# Altium schematic sheet TEST_USB.SchDoc
size A4
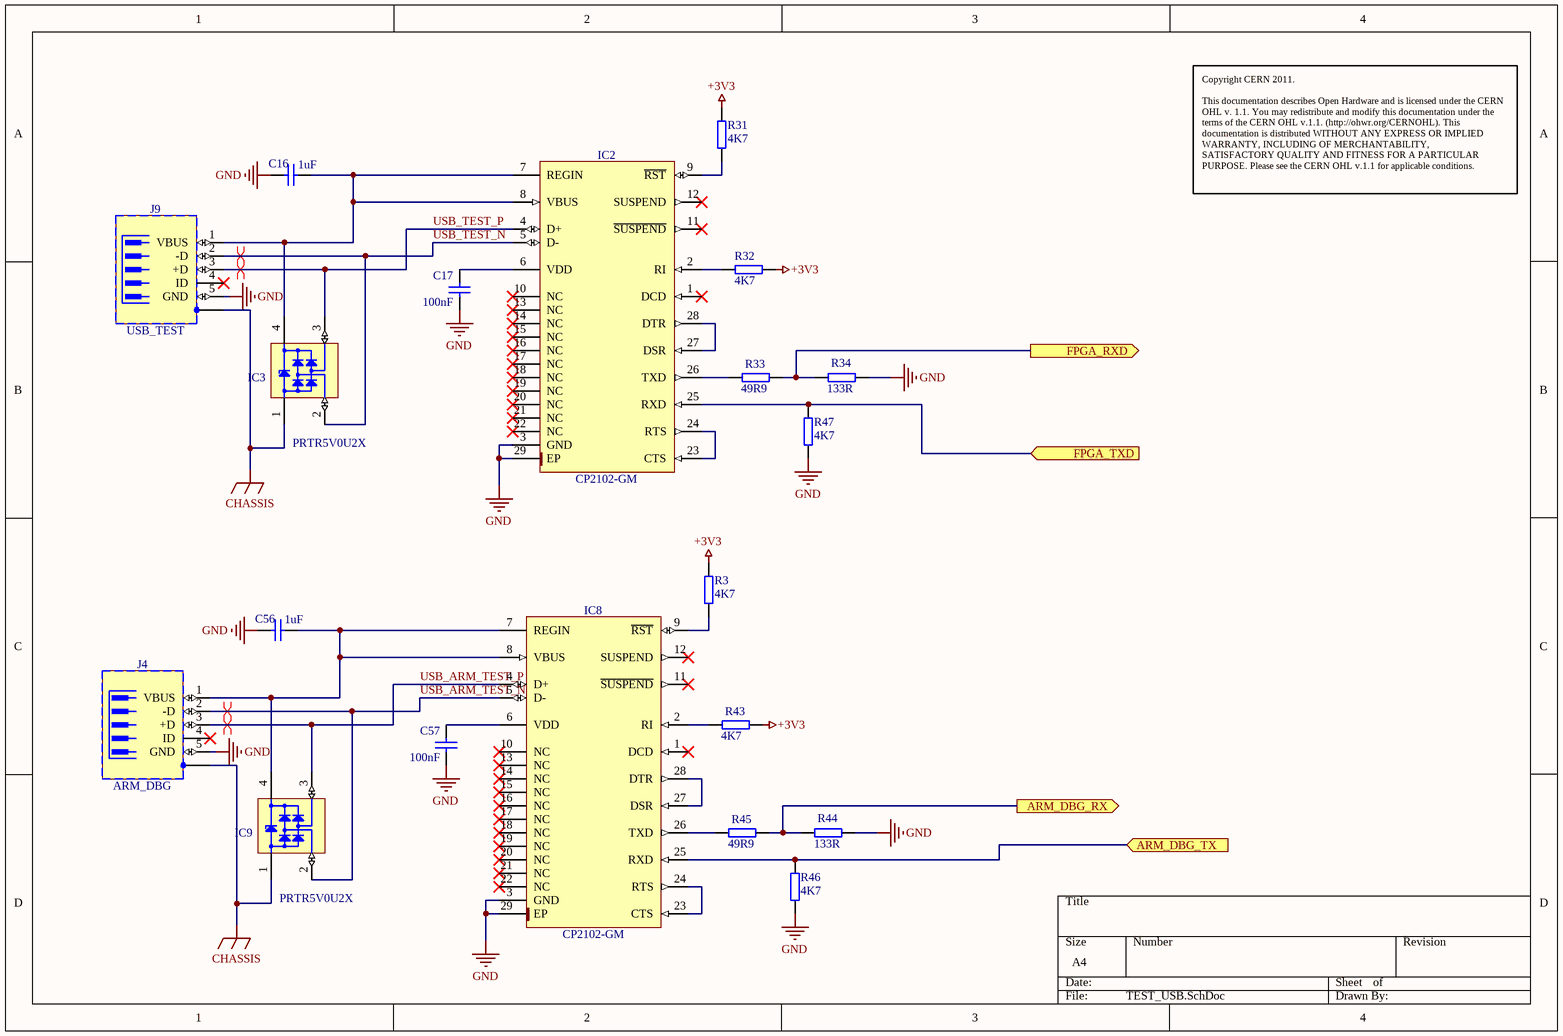
[diagram p0: TEST_USB.SchDoc]

## Parts
C16  1uF  [CC1608-0603]
C17  100nF  [CC1608-0603]
C56  1uF  [CC1608-0603]
C57  100nF  [CC1608-0603]
IC2  CP2102-GM  [QFN50P500X500X100-29N-S335]
IC3  PRTR5V0U2X  [SOT190P230X110-4N]
IC8  CP2102-GM  [QFN50P500X500X100-29N-S335]
IC9  PRTR5V0U2X  [SOT190P230X110-4N]
J4  ARM_DBG  [TYCO_1734035-1]
J9  USB_TEST  [TYCO_1734035-1]
R3  4K7  [0603]
R31  4K7  [0603]
R32  4K7  [0603]
R33  49R9  [0603]
R34  133R  [0603]
R43  4K7  [0603]
R44  133R  [0603]
R45  49R9  [0603]
R46  4K7  [0603]
R47  4K7  [0603]

## Ports
ARM_DBG_RX (out), ARM_DBG_TX (in), FPGA_RXD (out), FPGA_TXD (in)

## Nets
+3V3: R3.1 R31.1 R32.2 R43.2
CHASSIS: IC3.1(GND) IC9.1(GND) J4.6(SH) J9.6(SH)
GND: C16.1 C17.2 C56.1 C57.2 IC2.3(GND) IC2.29(EP) IC8.3(GND) IC8.29(EP) J4.5(GND) J9.5(GND) R34.2 R44.2 R46.2 R47.2
ARM_DBG_RX: R44.1 R45.2 ; port ARM_DBG_RX
ARM_DBG_TX: IC8.25(RXD) R46.1 ; port ARM_DBG_TX
FPGA_RXD: R33.2 R34.1 ; port FPGA_RXD
FPGA_TXD: IC2.25(RXD) R47.1 ; port FPGA_TXD
USB_ARM_TEST_N: IC8.5(D-) IC9.2(I/O1) J4.2(-D)
USB_ARM_TEST_P: IC8.4(D+) IC9.3(I/O2) J4.3(+D)
USB_TEST_N: IC2.5(D-) IC3.2(I/O1) J9.2(-D)
USB_TEST_P: IC2.4(D+) IC3.3(I/O2) J9.3(+D)
NetC16_2: C16.2 IC2.7(REGIN) IC2.8(VBUS) IC3.4(VCC) J9.1(VBUS)
NetC17_1: C17.1 IC2.6(VDD)
NetC56_2: C56.2 IC8.7(REGIN) IC8.8(VBUS) IC9.4(VCC) J4.1(VBUS)
NetC57_1: C57.1 IC8.6(VDD)
NetIC2_2: IC2.2(RI) R32.1
NetIC2_9: IC2.9(~{RST}) R31.2
NetIC2_23: IC2.23(CTS) IC2.24(RTS)
NetIC2_26: IC2.26(TXD) R33.1
NetIC2_27: IC2.27(DSR) IC2.28(DTR)
NetIC8_2: IC8.2(RI) R43.1
NetIC8_9: IC8.9(~{RST}) R3.2
NetIC8_23: IC8.23(CTS) IC8.24(RTS)
NetIC8_26: IC8.26(TXD) R45.1
NetIC8_27: IC8.27(DSR) IC8.28(DTR)

Not connected (* = marked no-connect by the designer): IC2 1(DCD)* 10(NC)* 11(~{SUSPEND})* 12(SUSPEND)* 13(NC)* 14(NC)* 15(NC)* 16(NC)* 17(NC)* 18(NC)* 19(NC)* 20(NC)* 21(NC)* 22(NC)*; IC8 1(DCD)* 10(NC)* 11(~{SUSPEND})* 12(SUSPEND)* 13(NC)* 14(NC)* 15(NC)* 16(NC)* 17(NC)* 18(NC)* 19(NC)* 20(NC)* 21(NC)* 22(NC)*; J4 4(ID)*; J9 4(ID)*

## Layout directives
differential pair: USB_ARM_TEST_N, USB_ARM_TEST_P, USB_TEST_N, USB_TEST_P

## Notes on the sheet
- Copyright CERN 2011.
  This documentation describes Open Hardware and is licensed under the CERN OHL v. 1.1. You may redistribute and modify this documentation under the terms of the CERN OHL v.1.1. (http://ohwr.org/CERNOHL). This documentation is distributed WITHOUT ANY EXPRESS OR IMPLIED WARRANTY, INCLUDING OF MERCHANTABILITY, SATISFACTORY QUALITY AND FITNESS FOR A PARTICULAR PURPOSE. Please see the CERN OHL v.1.1 for applicable conditions.

## Library data of the parts
C16 C56 = CC0603_1UF_25V_10%_X5R: Capacitor; Manufacturer1: Phycomp; Manufacturer1 PN: GRM188R61E105KA12D; TC: X5R; Tolerance: ±10%; Voltage: 25V; Published: 8-Jun-2000; LatestRevisionDate: 17-Jul-2002; LatestRevisionNote: Re-released for DXP Platform.; Publisher: Altium Limited; Distributor1: Digikey; Distributor1 PN: 490-3897-1-ND; Case: 0603; Value: 1uF
C17 C57 = CC0603_100NF_16V_10%_X7R: Capacitor; Manufacturer1: AVX; Manufacturer1 PN: 0603YC104KAT2A; TC: X7R; Tolerance: ±10%; Voltage: 16V; Published: 8-Jun-2000; LatestRevisionDate: 17-Jul-2002; LatestRevisionNote: Re-released for DXP Platform.; PackageReference: RAD-0.3; Publisher: Altium Limited; Distributor1: Digikey; Distributor1 PN: 478-1239-1-ND; Case: 0603; Value: 100nF
IC2 IC8 = CP2102-GM: Single-Chip USB to UART Bridge; Manufacturer: SILICON LABS; Table: Analog & Interface; Part Number: CP2102-GM; Component Kind: Standard; Component Type: Standard; Device: CP2102-GM; PackageDescription: QFN, 0.50mm Pitch, Square; 28 pin, 5.00mm L X 5.00mm W X 1.00mm H body (w/thermal tab 3.35 X 3.35mm),  IPC Medium Density; Part Description: Single-Chip USB to UART Bridge; Manufacturer Part Number: CP2102-GM; Pin Count: 29; Case: QFN28; Mounted: Yes; Socket: No; SMD: Yes; ComponentHeight: 1.0mm; Author: CERN DEM JLC; HelpURL: \\cern.ch\dfs\Applications\Altium\Datasheets\CP2102-GM.pdf; CreateDate: 3/3/2011; LatestRevisionDate: 3/3/2011
IC3 IC9 = PRTR5V0U2X: Ultra Low Capacitance Double Rail-to-Rail ESD Protection Diode; Part Description: Ultra Low Capacitance (1pF) Double Rail-to-Rail ESD Protection Diode (8kV); Manufacturer: PHILIPS NXP; Voltage: 5.5V; Table: Diodes; Part Number: PRTR5V0U2X; Component Kind: Standard; Component Type: Standard; Device: PRTR5V0U2X; PackageDescription: SOT143B, SOT, 1.90mm Pitch; 4 Pin, 1.30mm W X 2.90mm L X 1.10mm H body, IPC Medium Density; Manufacturer Part Number: PRTR5V0U2X; Pin Count: 4; Case: SOT143B; Mounted: Yes; Socket: No; SMD: Yes; ComponentHeight: 1.1mm; HelpURL: \\cern.ch\dfs\Applications\Altium\Datasheets\PRTR5V0U2X.pdf; Author: CERN DEM JLC; CreateDate: 3/22/2011; LatestRevisionDate: 3/22/2011
J4 J9 = TYCO_1734035-1: 5 Pin + 1 Shield Mini USB Type B Receptacle; Part Description: 5 Position, Right Angle, SMD Mini USB Type B Receptacle; Manufacturer: TYCO ELECTRONICS; Table: TYCO; Part Number: TYCO_1734035-1; Component Kind: Standard; Component Type: Standard; Pin Count: 6; Family: USB; Mounted: Yes; Socket: No; SMD: Yes; Status: None; Manufacturer Part Number: 1734035-1; ComponentHeight: 3.95mm; HelpURL: \\cern.ch\dfs\Applications\Altium\Datasheets\TYCO_1734035-1.pdf; Author: CERN DEM JLC; CreateDate: 02/05/2011; LatestRevisionDate: 02/05/2011
R3 R31 R32 R43 R46 R47 = R0603_4.7K_±1%_0.1W_100PPM: SMD Resistor; Manufacturer1: Panasonic; Manufacturer1 PN: ERJ-3EKF4701V; TCR: 100ppm; Power Rating: 0.1W; Tolerance: ±1%; Case: 0603; Distributor1: DigiKey; Distributor1 PN: P4.70KHCT-ND; Value: 4K7
R33 R45 = R0603_49R9_±1%_0.25W_100PPM: SMD Resistor; Manufacturer1: Vishay/Dale; Manufacturer1 PN: CRCW060349R9FKEAHP; TCR: 100ppm; Power Rating: 0.25W; Tolerance: ±1%; Case: 0603; Distributor1: DigiKey; Distributor1 PN: 541-49.9SCT-ND; Value: 49R9
R34 R44 = R0603_133R_±1%_0.1W_100PPM: SMD Resistor; Manufacturer1: Yageo; Manufacturer1 PN: 311-133HRCT-ND; TCR: 100ppm; Power Rating: 0.1W; Tolerance: ±1%; Case: 0603; Distributor1: DigiKey; Distributor1 PN: RC0603FR-07133RL; Value: 133R